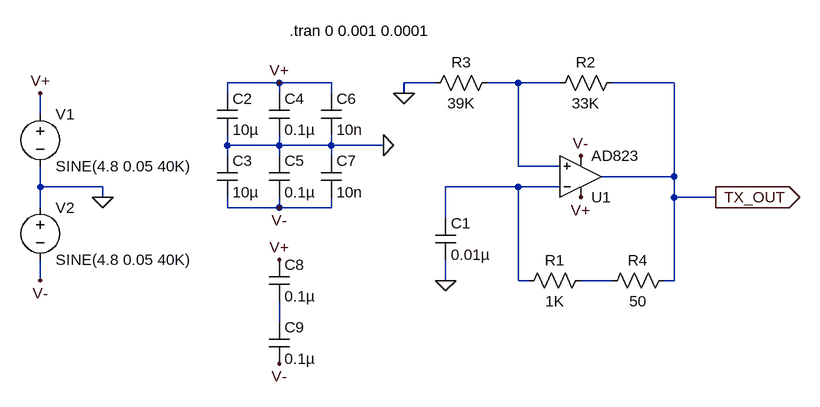
[diagram p0: schematic Transmitter_AD823_ideal_noisy.asc]
Transmitter_AD823_ideal_noisy.asc, the LTspice schematic file:
Version 4
SHEET 1 880 680
WIRE -208 48 -288 48
WIRE -128 48 -208 48
WIRE 32 48 -16 48
WIRE 160 48 112 48
WIRE 224 48 160 48
WIRE 400 48 304 48
WIRE -288 64 -288 48
WIRE -208 64 -208 48
WIRE -128 64 -128 48
WIRE -16 64 -16 48
WIRE -576 96 -576 64
WIRE -288 144 -288 128
WIRE -208 144 -208 128
WIRE -208 144 -288 144
WIRE -128 144 -128 128
WIRE -128 144 -208 144
WIRE -48 144 -128 144
WIRE -288 160 -288 144
WIRE -208 160 -208 144
WIRE -128 160 -128 144
WIRE 160 176 160 48
WIRE 224 176 160 176
WIRE 400 192 400 48
WIRE 400 192 288 192
WIRE -576 208 -576 176
WIRE -480 208 -576 208
WIRE 160 208 48 208
WIRE 224 208 160 208
WIRE -480 224 -480 208
WIRE 400 224 400 192
WIRE 464 224 400 224
WIRE -576 240 -576 208
WIRE -288 240 -288 224
WIRE -208 240 -208 224
WIRE -208 240 -288 240
WIRE -128 240 -128 224
WIRE -128 240 -208 240
WIRE 48 256 48 208
WIRE -576 352 -576 320
WIRE 48 352 48 320
WIRE 160 352 160 208
WIRE 176 352 160 352
WIRE 304 352 256 352
WIRE 400 352 400 224
WIRE 400 352 384 352
WIRE -208 416 -208 384
FLAG 48 352 0
FLAG -16 64 0
FLAG -480 224 0
FLAG -576 64 V+
FLAG 256 224 V+
FLAG -576 352 V-
FLAG 256 160 V-
FLAG 464 224 TX_OUT
IOPIN 464 224 Out
FLAG -208 240 V-
FLAG -208 48 V+
FLAG -48 144 0
FLAG -208 480 V-
FLAG -208 320 V+
SYMBOL cap 32 256 R0
SYMATTR InstName C1
SYMATTR Value 0.01µ
SYMATTR SpiceLine V=10 Irms=0 Rser=0.01 Lser=0
SYMBOL res 272 336 R90
WINDOW 0 0 56 VBottom 2
WINDOW 3 32 56 VTop 2
SYMATTR InstName R1
SYMATTR Value 1K
SYMATTR SpiceLine tol=1 pwr=0.1
SYMBOL res 320 32 R90
WINDOW 0 0 56 VBottom 2
WINDOW 3 32 56 VTop 2
SYMATTR InstName R2
SYMATTR Value 33K
SYMBOL res 128 32 R90
WINDOW 0 0 56 VBottom 2
WINDOW 3 32 56 VTop 2
SYMATTR InstName R3
SYMATTR Value 39K
SYMBOL voltage -576 80 R0
WINDOW 123 0 0 Left 0
WINDOW 39 0 0 Left 0
SYMATTR InstName V1
SYMATTR Value SINE(4.8 0.05 40K)
SYMBOL voltage -576 224 R0
WINDOW 123 0 0 Left 0
WINDOW 39 0 0 Left 0
SYMATTR InstName V2
SYMATTR Value SINE(4.8 0.05 40K)
SYMBOL res 400 336 R90
WINDOW 0 0 56 VBottom 2
WINDOW 3 32 56 VTop 2
SYMATTR InstName R4
SYMATTR Value 50
SYMBOL Opamps\\AD823 256 256 M180
SYMATTR InstName U1
SYMBOL cap -304 64 R0
SYMATTR InstName C2
SYMATTR Value 10µ
SYMATTR SpiceLine Rser=0.1
SYMBOL cap -304 160 R0
SYMATTR InstName C3
SYMATTR Value 10µ
SYMATTR SpiceLine Rser=0.1
SYMBOL cap -224 64 R0
SYMATTR InstName C4
SYMATTR Value 0.1µ
SYMATTR SpiceLine Rser=0.1
SYMBOL cap -224 160 R0
SYMATTR InstName C5
SYMATTR Value 0.1µ
SYMATTR SpiceLine Rser=0.1
SYMBOL cap -144 64 R0
SYMATTR InstName C6
SYMATTR Value 10n
SYMATTR SpiceLine Rser=0.1
SYMBOL cap -144 160 R0
SYMATTR InstName C7
SYMATTR Value 10n
SYMATTR SpiceLine Rser=0.1
SYMBOL cap -224 320 R0
SYMATTR InstName C8
SYMATTR Value 0.1µ
SYMBOL cap -224 416 R0
SYMATTR InstName C9
SYMATTR Value 0.1µ
TEXT -192 -32 Left 2 !.tran 0 0.001 0.0001

The netlist it stands for:
* Transmitter_AD823_ideal_noisy.asc
C1 N002 0 0.01µ V=10 Irms=0 Rser=0.01 Lser=0
R1 N003 N002 1K tol=1 pwr=0.1
R2 TX_OUT N001 33K
R3 N001 0 39K
V1 V+ 0 SINE(4.8 0.05 40K)
V2 0 V- SINE(4.8 0.05 40K)
R4 TX_OUT N003 50
XU1 N001 N002 V+ V- TX_OUT AD823  ; pins In+ In- V+ V- OUT
C2 V+ 0 10µ Rser=0.1
C3 0 V- 10µ Rser=0.1
C4 V+ 0 0.1µ Rser=0.1
C5 0 V- 0.1µ Rser=0.1
C6 V+ 0 10n Rser=0.1
C7 0 V- 10n Rser=0.1
C8 V+ N004 0.1µ
C9 N004 V- 0.1µ
.tran 0 0.001 0.0001
.lib ADI.lib
.backanno
.end